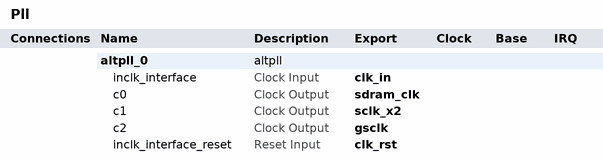
[diagram p0: system contents]
# Platform Designer (Qsys) system Pll, Cyclone 10 LP 10CL010YE144I7G
# Parameters at their usual value, and those the tool derives, are not listed.
package require qsys
create_system Pll
set_project_property DEVICE_FAMILY {Cyclone 10 LP}
set_project_property DEVICE 10CL010YE144I7G

add_instance altpll_0 altpll 18.1
set_instance_parameter_value altpll_0 CLK0_DIVIDE_BY 1
set_instance_parameter_value altpll_0 CLK0_MULTIPLY_BY 9
set_instance_parameter_value altpll_0 CLK1_DIVIDE_BY 1
set_instance_parameter_value altpll_0 CLK1_DUTY_CYCLE 50
set_instance_parameter_value altpll_0 CLK1_MULTIPLY_BY 4
set_instance_parameter_value altpll_0 CLK1_PHASE_SHIFT 0
set_instance_parameter_value altpll_0 CLK2_DIVIDE_BY 5000000
set_instance_parameter_value altpll_0 CLK2_DUTY_CYCLE 50
set_instance_parameter_value altpll_0 CLK2_MULTIPLY_BY 15882353
set_instance_parameter_value altpll_0 CLK2_PHASE_SHIFT 0
set_instance_parameter_value altpll_0 INCLK0_INPUT_FREQUENCY 100000
set_instance_parameter_value altpll_0 PORT_ARESET PORT_UNUSED
set_instance_parameter_value altpll_0 PORT_LOCKED PORT_UNUSED
set_instance_parameter_value altpll_0 PORT_clk1 PORT_USED
set_instance_parameter_value altpll_0 PORT_clk2 PORT_USED
set_instance_parameter_value altpll_0 PORT_clk3 PORT_UNUSED

# exported interfaces
add_interface clk_in clock sink
set_interface_property clk_in EXPORT_OF altpll_0.inclk_interface
add_interface clk_rst reset sink
set_interface_property clk_rst EXPORT_OF altpll_0.inclk_interface_reset
add_interface gsclk clock source
set_interface_property gsclk EXPORT_OF altpll_0.c2
add_interface sclk_x2 clock source
set_interface_property sclk_x2 EXPORT_OF altpll_0.c1
add_interface sdram_clk clock source
set_interface_property sdram_clk EXPORT_OF altpll_0.c0

set_interconnect_requirement {$system} qsys_mm.clockCrossingAdapter HANDSHAKE
set_interconnect_requirement {$system} qsys_mm.enableEccProtection FALSE
set_interconnect_requirement {$system} qsys_mm.insertDefaultSlave FALSE
set_interconnect_requirement {$system} qsys_mm.maxAdditionalLatency 1

save_system Pll.qsys
